# Altium schematic sheet MCU.SchDoc
size A; SheetNumber: 4; SheetTotal: 6; SPICEModelCacheDXVWNVZD: <root> / <DocumentId>DXVWNVZD</DocumentId> / <CacheFrame Number="0"> / <Model Name="diode" Kind="MDL"> / <Text>*Default Diode / *Diode Pinout: A,K / .MODEL DIODE D()</Text> / </Model> / </CacheFrame> / </root>
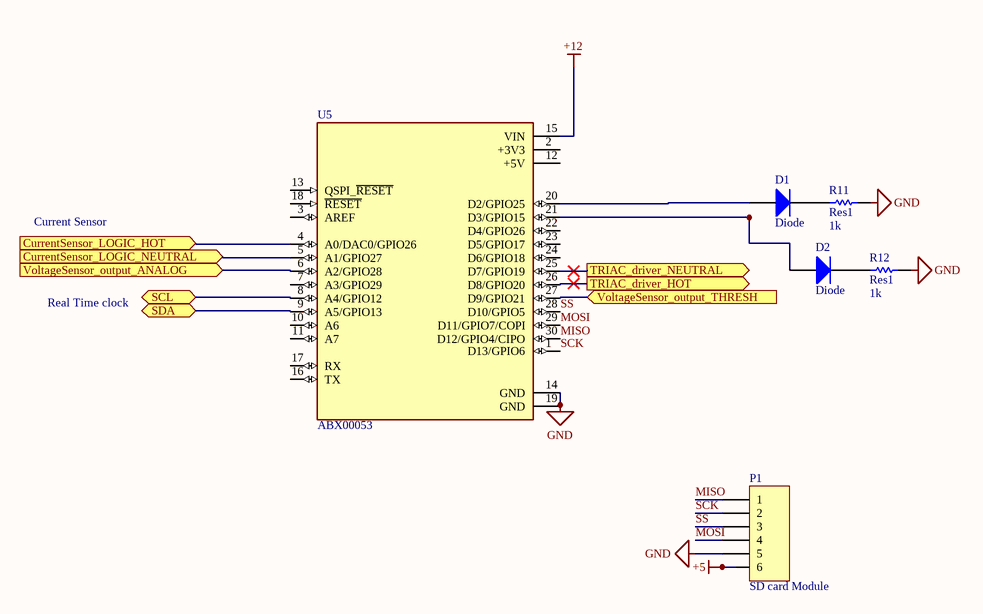
[diagram p0: MCU.SchDoc]

## Parts
D1  Diode  [0603]
D2  Diode  [0603]
P1  SD card Module  [HDR1X6]
R11  Res1  value 1k  [0603]
R12  Res1  value 1k  [0603]
U5  ABX00053  [MODULE_ABX00053]

## Ports
CurrentSensor_LOGIC_HOT (in), CurrentSensor_LOGIC_NEUTRAL (in), SCL (bidir), SDA (bidir), TRIAC_driver_HOT (out), TRIAC_driver_NEUTRAL (out), VoltageSensor_output_ANALOG (in), VoltageSensor_output_THRESH (in)

## Nets
+5: P1.6
+12: U5.15(VIN)
GND: P1.5 R11.1 R12.1 U5.14(GND) U5.19(GND)
CurrentSensor_LOGIC_HOT: U5.4(A0/DAC0/GPIO26) ; port CurrentSensor_LOGIC_HOT
CurrentSensor_LOGIC_NEUTRAL: U5.5(A1/GPIO27) ; port CurrentSensor_LOGIC_NEUTRAL
MISO: P1.1 U5.30(D12/GPIO4/CIPO)
MOSI: P1.4 U5.29(D11/GPIO7/COPI)
SCK: P1.2 U5.1(D13/GPIO6)
SCL: U5.8(A4/GPIO12) ; port SCL
SDA: U5.9(A5/GPIO13) ; port SDA
SS: P1.3 U5.28(D10/GPIO5)
TRIAC_driver_HOT: U5.26(D8/GPIO20) ; port TRIAC_driver_HOT
TRIAC_driver_NEUTRAL: U5.25(D7/GPIO19) ; port TRIAC_driver_NEUTRAL
VoltageSensor_output_ANALOG: U5.6(A2/GPIO28) ; port VoltageSensor_output_ANALOG
VoltageSensor_output_THRESH: U5.27(D9/GPIO21) ; port VoltageSensor_output_THRESH
NetD1_1: D1.1(A) U5.20(D2/GPIO25)
NetD1_2: D1.2(K) R11.2
NetD2_1: D2.1(A) U5.21(D3/GPIO15)
NetD2_2: D2.2(K) R12.2

Not connected (* = marked no-connect by the designer): U5 2(+3V3) 3(AREF) 7(A3/GPIO29) 10(A6) 11(A7) 12(+5V) 13(QSPI_~{RESET}) 16(TX) 17(RX) 18(~{RESET}) 22(D4/GPIO26) 23(D5/GPIO17) 24(D6/GPIO18)

## Notes on the sheet
- Current Sensor
- Real Time clock

## Library data of the parts
D1 D2 = Diode: Default Diode; Published: 8-Jun-2000; LatestRevisionDate: 17-Jul-2002; LatestRevisionNote: Re-released for DXP Platform.; PackageVersion: Sep-1996; PackageReference: SMC; Publisher: Altium Limited; PackageDescription: DO-214-AB/SMC; 2 C-Bend Leads; Body 7.9 x 5.9 mm, inc. leads (LxW); Code_JEDEC: DO-214-AB
P1 = Header 6: Header, 6-Pin; LatestRevisionDate: 17-Jul-2002; LatestRevisionNote: Re-released for DXP Platform.; Publisher: Altium Limited
R11 R12 = Res1: Resistor; Published: 8-Jun-2000; LatestRevisionDate: 17-Jul-2002; LatestRevisionNote: Re-released for DXP Platform.; PackageReference: AXIAL-0.3; Publisher: Altium Limited; PackageDescription: Axial Device, Thru-Hole; 2 Leads; 0.3 in Pin Spacing
U5 = ABX00053: NINA-W102, RP2040 Arduino Nano RP2040 Connect with Headers series ARMÂ® CortexÂ®-M0+ MCU 32-Bit Embedded Evaluation Board; Value: *; SnapEDA_Link: https://www.snapeda.com/parts/ABX00053/Arduino/view-part/?ref=snap; MF: Arduino; Purchase-URL: https://pricing.snapeda.com/search/part/ABX00053/?ref=eda; Check_prices: https://www.snapeda.com/parts/ABX00053/Arduino/view-part/?ref=eda; Digi-Key_Part_Number: 1050-ABX00053-ND; Package: None; MP: ABX00053